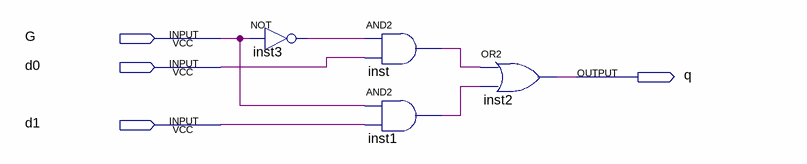
[diagram p0: schematic sheet]
// Quartus schematic mux2.bdf as structural Verilog: 4 symbols, 4 pins
module mux2 (
  input  G,
  input  d0,
  input  d1,
  output q
);

  wire inst1_out, inst3_out, inst_out;

  not inst3 (inst3_out, G);
  and inst (inst_out, inst3_out, d0);
  and inst1 (inst1_out, G, d1);
  or inst2 (q, inst_out, inst1_out);
endmodule
